# EAGLE design akabeacon_square (EAGLE 7.2.0)
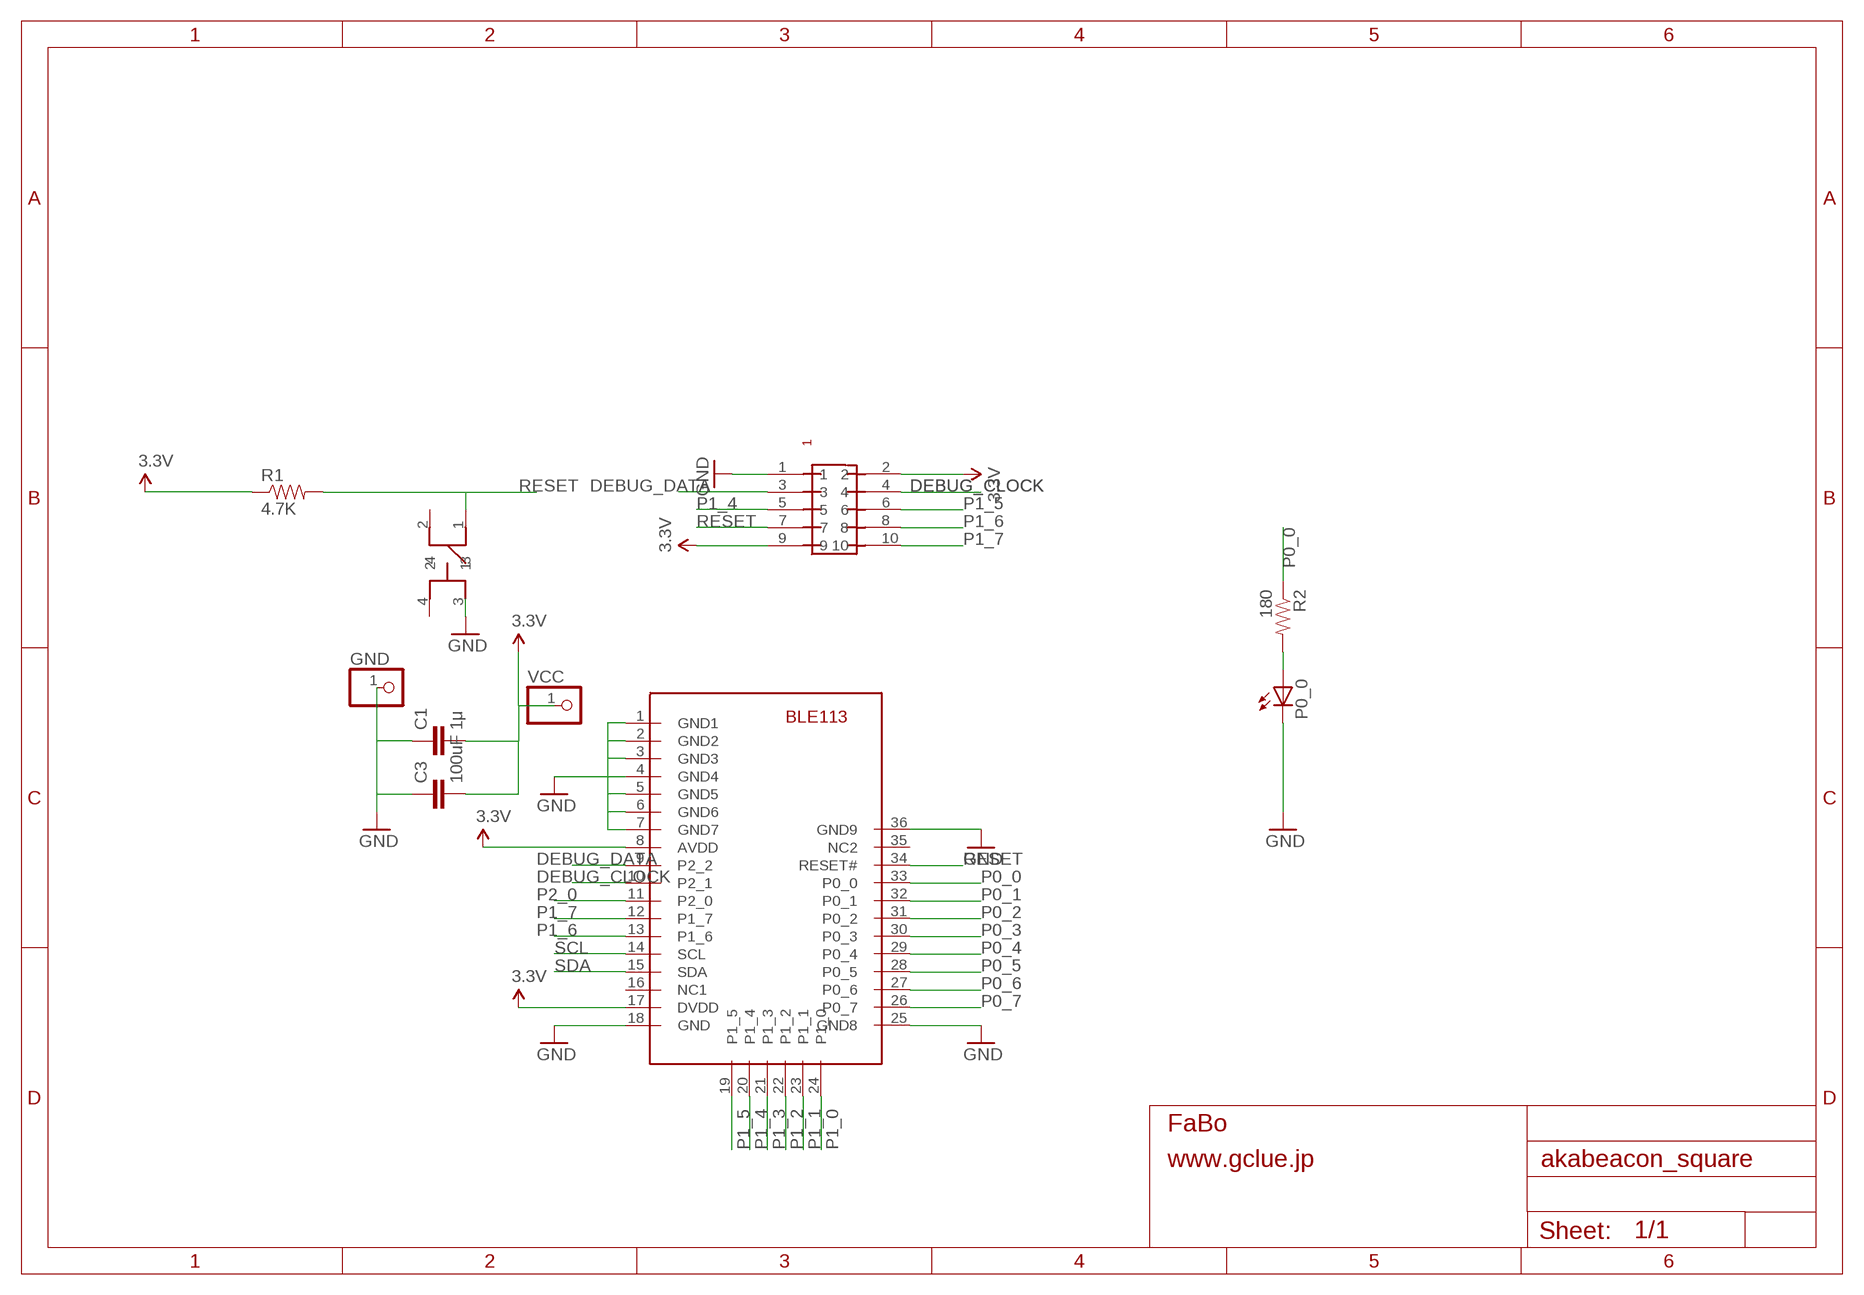
[diagram p0: schematic, sheet 1]

## Parts
C1  1μ  CAP0603-CAP  [0603-CAP]
C3  100uF  10UF-6.3V-20%(1206)  [1206]
GND  PINHD-1X1CB  [1X01-CLEANBIG]
P0_0  LEDCHIP-LED0603  [CHIP-LED0603]
R1  4.7K  RESISTOR0603-RES  [0603-RES]
R2  180  RESISTOR0603-RES  [0603-RES]
U$2  PIN-HEADER-SMT(1.27MM)2X5  [PIN-HEADER-SMT(1.27MM)2X5]
U$5  BLE113  [BLE113]
U$8  SWITCH-LS6J2M-T  [SWICTH-LS6J2M-T]
VCC  PINHD-1X1CB  [1X01-CLEANBIG]

## Nets
3.3V: C1.2 C3.2 R1.1 U$2.2 U$2.9 U$5.8(AVDD) U$5.17(DVDD) VCC.1
DEBUG_CLOCK: U$2.4 U$5.10(P2_1)
DEBUG_DATA: U$2.3 U$5.9(P2_2)
GND: C1.1 C3.1 GND.1 P0_0.C U$2.1 U$5.1(GND1) U$5.2(GND2) U$5.3(GND3) U$5.4(GND4) U$5.5(GND5) U$5.6(GND6) U$5.7(GND7) U$5.18(GND) U$5.25(GND8) U$5.36(GND9) U$8.3
N$2: P0_0.A R2.2
P0_0: R2.1 U$5.33(P0_0)
P0_1: U$5.32(P0_1)
P0_2: U$5.31(P0_2)
P0_3: U$5.30(P0_3)
P0_4: U$5.29(P0_4)
P0_5: U$5.28(P0_5)
P0_6: U$5.27(P0_6)
P0_7: U$5.26(P0_7)
P1_0: U$5.24(P1_0)
P1_1: U$5.23(P1_1)
P1_2: U$5.22(P1_2)
P1_3: U$5.21(P1_3)
P1_4: U$2.5 U$5.20(P1_4)
P1_5: U$2.6 U$5.19(P1_5)
P1_6: U$2.8 U$5.13(P1_6)
P1_7: U$2.10 U$5.12(P1_7)
P2_0: U$5.11(P2_0)
RESET: R1.2 U$2.7 U$5.34(RESET#) U$8.1
SCL: U$5.14(SCL)
SDA: U$5.15(SDA)
Unconnected: U$5.16(NC1) U$5.35(NC2) U$8.2 U$8.4

## Library data of the parts
C1 = SparkFun:CAP: Capacitor Standard 0603 ceramic capacitor, and 0.1" leaded capacitor.
C3 = SparkFun-Capacitors:10UF-6.3V-20%(1206): CAP-10057 Ceramic; PROD_ID: CAP-10057; VALUE: 10uF
GND VCC = adafruit:PINHD-1X1: Pin header 1x1 for 0.1" spacing With round pins
P0_0 = led:LED: LED OSRAM: - CHIPLED LG R971, LG N971, LY N971, LG Q971, LY Q971, LO R971, LY R971 LH N974, LH R974 LS Q976, LO Q976, LY Q976 LO Q996 - Hyper CHIPLED LW Q18S LB Q993, LB Q99A, LB R99A - SideLED LS A670, LO A670, LY A670, LG A670, LP A670 LB A673, LV A673, LT A673, LW A673 LH A674 LY A675 LS A676, LA A676, LO A676, LY A676, LW A676 LS A679, LY A679, LG A679 - Hyper Micro SIDELED® LS Y876, LA Y876, LO Y876, LY Y876 LT Y87S - SmartLED LW L88C, LW L88S LB L89C, LB L89S, LG L890 LS L89K, LO L89K, LY L89K LS L896, LA L896, LO L896, LY L896 - TOPLED LS T670, LO T670, LY T670, LG T670, LP T670 LSG T670, LSP T670, LSY T670, LOP T670, LYG T670 LG T671, LOG T671, LSG T671 LB T673, LV T673, LT T673, LW T673 LH T674 LS T676, LA T676, LO T676, LY T676, LB T676, LH T676, LSB T676, LW T676 LB T67C, LV T67C, LT T67C, LS T67K, LO T67K, LY T67K, LW E67C LS E67B, LA E67B, LO E67B, LY E67B, LB E67C, LV E67C, LT E67C LW T67C LS T679, LY T679, LG T679 LS T770, LO T770, LY T770, LG T770, LP T770 LB T773, LV T773, LT T773, LW T773 LH T774 LS E675, LA E675, LY E675, LS T675 LS T776, LA T776, LO T776, LY T776, LB T776 LHGB T686 LT T68C, LB T68C - Hyper Mini TOPLED® LB M676 - Mini TOPLED Santana® LG M470 LS M47K, LO M47K, LY M47K Source: http://www.osram.convergy.de LUXEON: - LUMILED® LXK2-PW12-R00, LXK2-PW12-S00, LXK2-PW14-U00, LXK2-PW14-V00 LXK2-PM12-R00, LXK2-PM12-S00, LXK2-PM14-U00 LXK2-PE12-Q00, LXK2-PE12-R00, LXK2-PE12-S00, LXK2-PE14-T00, LXK2-PE14-U00 LXK2-PB12-K00, LXK2-PB12-L00, LXK2-PB12-M00, LXK2-PB14-N00, LXK2-PB14-P00, LXK2-PB14-Q00 LXK2-PR12-L00, LXK2-PR12-M00, LXK2-PR14-Q00, LXK2-PR14-R00 LXK2-PD12-Q00, LXK2-PD12-R00, LXK2-PD12-S00 LXK2-PH12-R00, LXK2-PH12-S00 LXK2-PL12-P00, LXK2-PL12-Q00, LXK2-PL12-R00 Source: www.luxeon.com KINGBRIGHT: KA-3528ASYC Source: www.kingbright.com
R1 R2 = SparkFun:RESISTOR: Resistor Basic schematic elements and footprints for 0603, 1206, and PTH resistors.
U$2 = gclue:PIN-HEADER-SMT(1.27MM)2X5: PIN-HEADER-SMT (1.27MM) 2x5
U$5 = gclue:BLE113
U$8 = gclue:SWITCH-LS6J2M-T

## Board
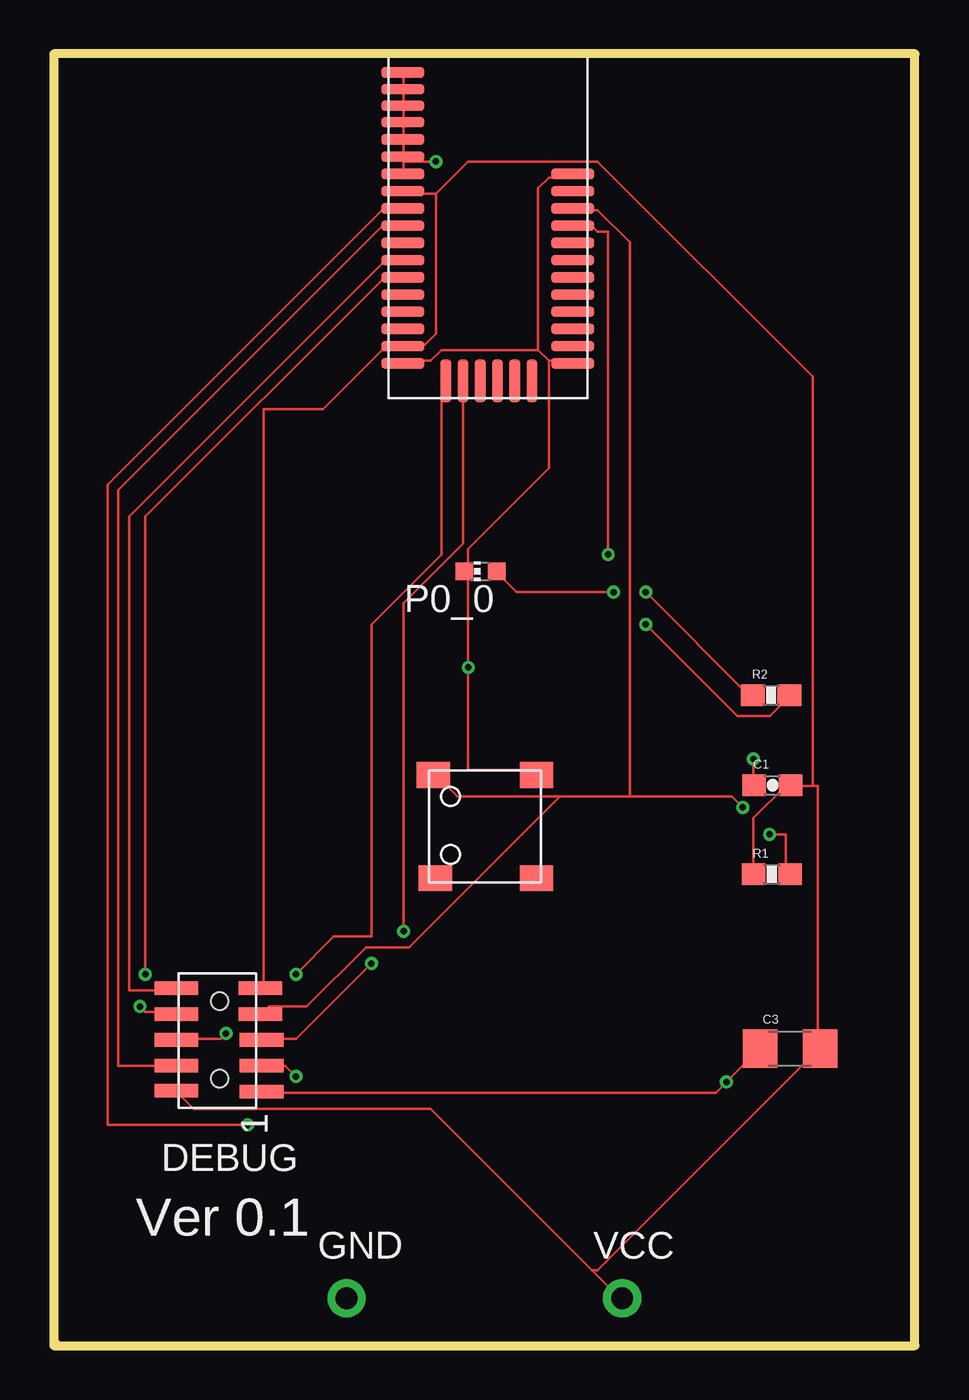
[diagram p1: board, top side]
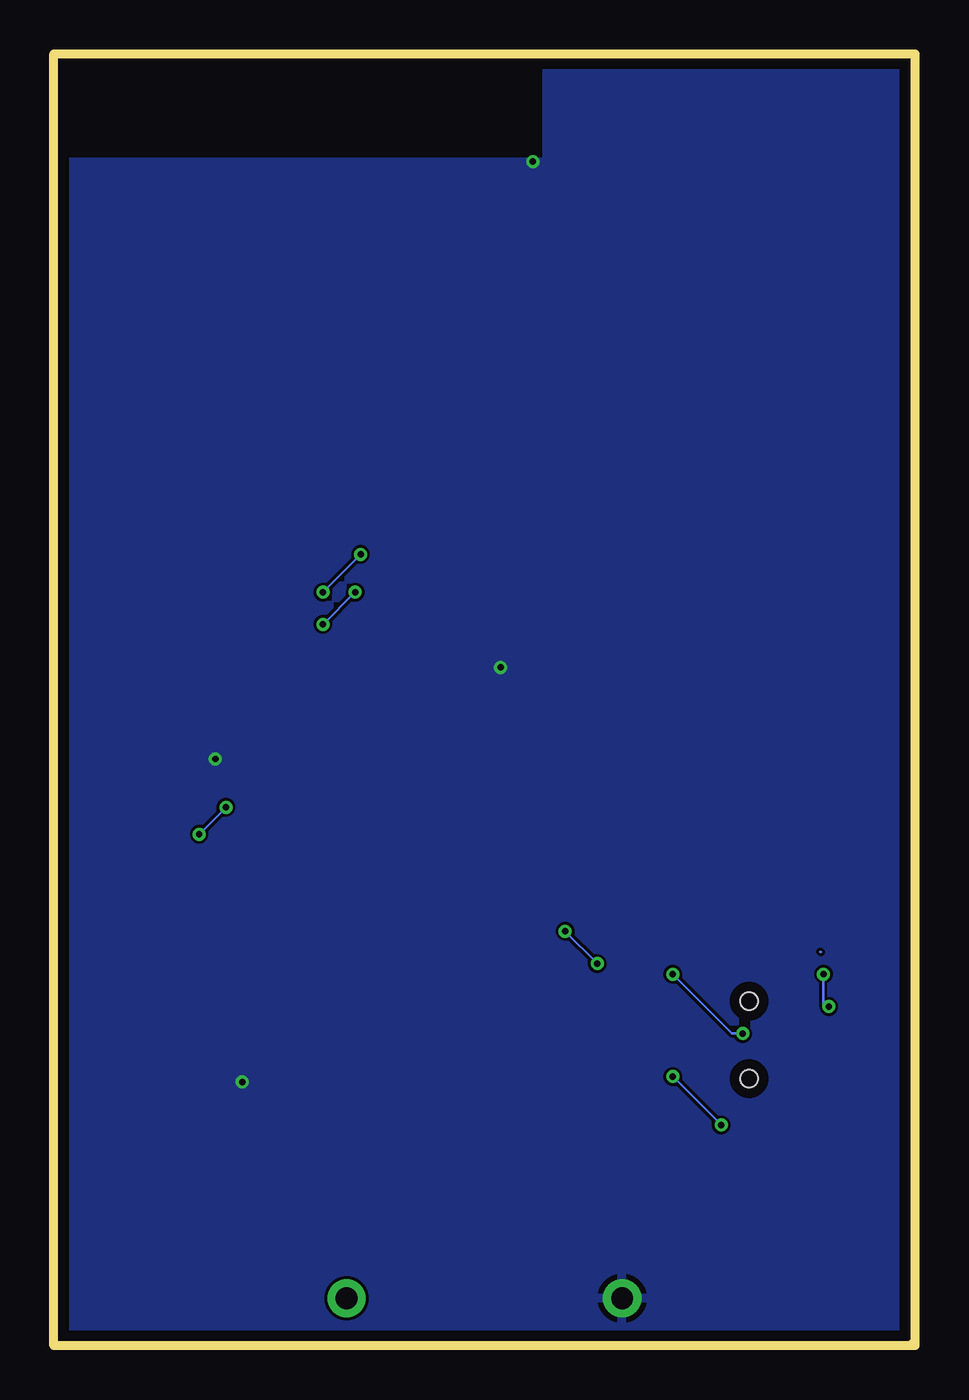
[diagram p2: board, bottom side, seen from below]

Size 40 x 60 mm. Coordinates in mm from the lower left corner, seen from the top.
Outline: 0.1,0.1 0,0
Outline: 0,0 40,0 40,60 0,60 0,0
Copper layers (1+2*15+16): Top 0.018mm / dielectric 0.25mm / Route2 0.035mm / dielectric 1mm / Route15 0.035mm / dielectric 0.25mm / Bottom 0.018mm
Design rules "pban_5mil-l4": minimum track width 5mil, minimum drill 0.3mm, track to track 5mil, track to pad 0.229mm, pad to pad 5mil, via to via 5mil, smd to smd 5mil, copper to edge 0.5mm, drill to drill 0.5mm, minimum pad ring 0.15mm, minimum via ring 0.15mm, stop-mask expansion 4mil, vias tented up to drill 0.35mm, thermal gap 10mil

### Footprints (pad centres in the part's own frame; a part is rotated, then mirrored left to right if it is on the bottom)
0603-CAP = smd 1.1 x 1: 1 -0.85,0; 2 0.85,0
1206 = smd 1.6 x 1.8: 1 -1.4,0; 2 1.4,0
1X01-CLEANBIG = drill 1.016 pad 1.778: 1 0,0
CHIP-LED0603 = smd 0.8 x 0.8: A 0,-0.75; C 0,0.75
0603-RES = smd 1.1 x 1: 1 -0.85,0; 2 0.85,0
PIN-HEADER-SMT(1.27MM)2X5 = smd 0.635 x 2.032: 1 -2.4,-1.95; 2 -2.35,2; 3 -1.2,-1.95; 4 -1.2,2; 5 0,-1.95; 6 0,2; 7 1.2,-1.9; 8 1.2,2; 9 2.4,-1.9; 10 2.4,2 | hole 0.8: 1.8,0; -1.8,0
BLE113 = smd 2 x 0.5: 1 -5.08,5.08; 2 -5.08,4.31; 3 -5.08,3.54; 4 -5.08,2.77; 5 -5.08,1.97; 6 -5.08,1.17; 7 -5.08,0.37; 8 -5.08,-0.43; 9 -5.08,-1.23; 10 -5.08,-2.03; 11 -5.08,-2.83; 12 -5.08,-3.63; 13 -5.08,-4.43; 14 -5.08,-5.23; 15 -5.08,-6.03; 16 -5.08,-6.83; 17 -5.08,-7.63; 18 -5.08,-8.43; 25 2.82,-8.43; 26 2.82,-7.63; 27 2.82,-6.83; 28 2.82,-6.03; 29 2.82,-5.23; 30 2.82,-4.43; 31 2.82,-3.63; 32 2.82,-2.83; 33 2.82,-2.03; 34 2.82,-1.23; 35 2.82,-0.43; 36 2.82,0.37 | smd 0.5 x 2: 19 -3.08,-9.23; 20 -2.28,-9.23; 21 -1.48,-9.23; 22 -0.68,-9.23; 23 0.12,-9.23; 24 0.92,-9.23
SWICTH-LS6J2M-T = smd 1.55 x 1.2: 1 -2.4,2.4; 2 -2.3,-2.4; 3 2.4,2.4; 4 2.4,-2.4

### Placement (x,y rotation side)
C1  33.38,26.03 0 top
C3  34.2,13.8 0 top
GND  13.6,2.2 0 top
P0_0  19.82,35.97 90 top
R1  33.35,21.89 0 top
R2  33.32,30.21 0 top
U$2  7.7,14.2 90 top
U$5  21.29,54.05 0 top
U$8  20.02,24.11 0 top
VCC  26.4,2.2 0 top

### Tracks (layer width: path | path; a pad name or v marks a point on that pad's centre or on a via)
3.3V
  Top 0.127: 17.75,53.5 17.75,47 17.25,46.5 16.25,46.5 U$5.17 16,46.25 15.25,46.25 12.5,43.5 9.75,43.5 9.75,16.75 U$2.9 | 17.75,53.5 16.25,53.5 U$5.8 | R1.1 32.5,24.5 34,26 C1.2 34.25,26 35.25,26 | 35.25,26 35.5,26 35.5,14 C3.2 35.5,13.75 25.25,3.5 25,3.5 | 25,3.5 26.25,2.25 VCC.1 | 25,3.5 17.5,11 6.5,11 5.75,11.75 U$2.2 | 17.75,53.5 19.25,55 25.25,55 35.25,45 35.25,26
AGND
  Bottom 0.127: 4.4,18.3 4.36,18.28
DEBUG_CLOCK
  Top 0.127: U$2.4 3,13 3,39.75 15.25,52 16,52 U$5.10
DEBUG_DATA  (via drill 0.3)
  Top 0.127: v9,10.25 2.5,10.25 2.5,40 15.25,52.75 16,52.75 U$5.9 | v11.25,12.5 10.75,13 U$2.3
  Bottom 0.127: v11.25,12.5 v9,10.25
GND  (via drill 0.3)
  Top 0.127: U$8.3 22.25,26.75 19.25,26.75 v19.25,31.5 19.25,35.75 P0_0.C 19.25,36 19.25,37 23,40.75 23,45.75 | 22.5,46.25 18,46.25 17.5,45.75 16.25,45.75 U$5.18 | 23,45.75 22.5,46.25 | 23,45.75 24,45.75 U$5.25 | 22.5,46.25 22.5,53.75 23,54.25 24,54.25 U$5.36 | C3.1 v31.25,12.25 30.75,11.75 9.75,11.75 U$2.1 | U$5.1 16.25,59 16.25,58.5 U$5.2 16.25,58.25 16.25,57.75 U$5.3 16.25,57.5 16.25,57 U$5.4 16.25,56.75 16.25,56.25 U$5.5 16.25,56 16.25,55.25 U$5.6 16.25,55 | v32.5,27.25 32.5,26.25 C1.1 | 16.25,55 v17.75,55 | 16.25,55 16.25,54.5 U$5.7
  pour Bottom: -1.2,-2.1 42.2,-2.1 42.2,55 17.1,55 17.1,61 -1.4,61 -1.4,-2.2
N$2  (via drill 0.3)
  Top 0.127: v26,35 21.5,35 20.75,35.75 P0_0.A | v27.5,33.5 31.75,29.25 33.25,29.25 34,30 R2.2
  Bottom 0.127: v27.5,33.5 v26,35
P0_0  (via drill 0.3)
  Top 0.127: v27.5,35 32.25,30.25 R2.1 | v25.75,36.75 25.75,51.75 25.25,51.75 25,52 24.25,52 U$5.33
  Bottom 0.127: v25.75,36.75 v27.5,35
P1_4  (via drill 0.3)
  Top 0.127: v16.25,19.25 16.25,34.5 19,37.25 19,44.75 U$5.20 | v14.75,17.75 11.25,14.25 9.75,14.25 U$2.5
  Bottom 0.127: v14.75,17.75 v16.25,19.25
P1_5  (via drill 0.3)
  Top 0.127: v11.25,17.25 13,19 14.75,19 14.75,33.5 18,36.75 18,44.75 U$5.19 | v8,14.5 7.75,14.25 5.75,14.25 U$2.6
  Bottom 0.127: v11.25,17.25 8.5,14.5 v8,14.5
P1_6  (via drill 0.3)
  Top 0.127: v4.25,17.25 4.25,38.5 15.25,49.5 16,49.5 U$5.13 | v4,15.75 4.25,15.5 5.5,15.5 U$2.8
  Bottom 0.127: v4.25,17.25 4.25,15.75 v4,15.75
P1_7
  Top 0.127: U$5.12 16,50.25 15.25,50.25 3.5,38.5 3.5,16.5 5.5,16.5 U$2.10
RESET  (via drill 0.3)
  Top 0.127: v33.25,23.75 34,23.75 34,22 R1.2 | v32,25 31.5,25.5 26.75,25.5 | 23.5,25.5 18.75,25.5 17.75,26.5 U$8.1 | 23.5,25.5 26.75,25.5 | 26.75,25.5 26.75,51.25 25.25,52.75 24.25,52.75 U$5.34 | 23.5,25.5 16.5,18.5 14.5,18.5 11.75,15.75 10,15.75 9.75,15.5 U$2.7
  Bottom 0.127: v32,25 v33.25,23.75

### Text on the board
tPlace: DEBUG | Ver 0.1